# Altium schematic sheet RG191-M2 Header.SchDoc: Laird RG191-M2 LoRa Concentrator Daughterboard
size Letter; DrawnBy: MTAN; Organization: Altium Limited; DocumentNumber: 1; Revision: A; SheetNumber: 1; SheetTotal: 2
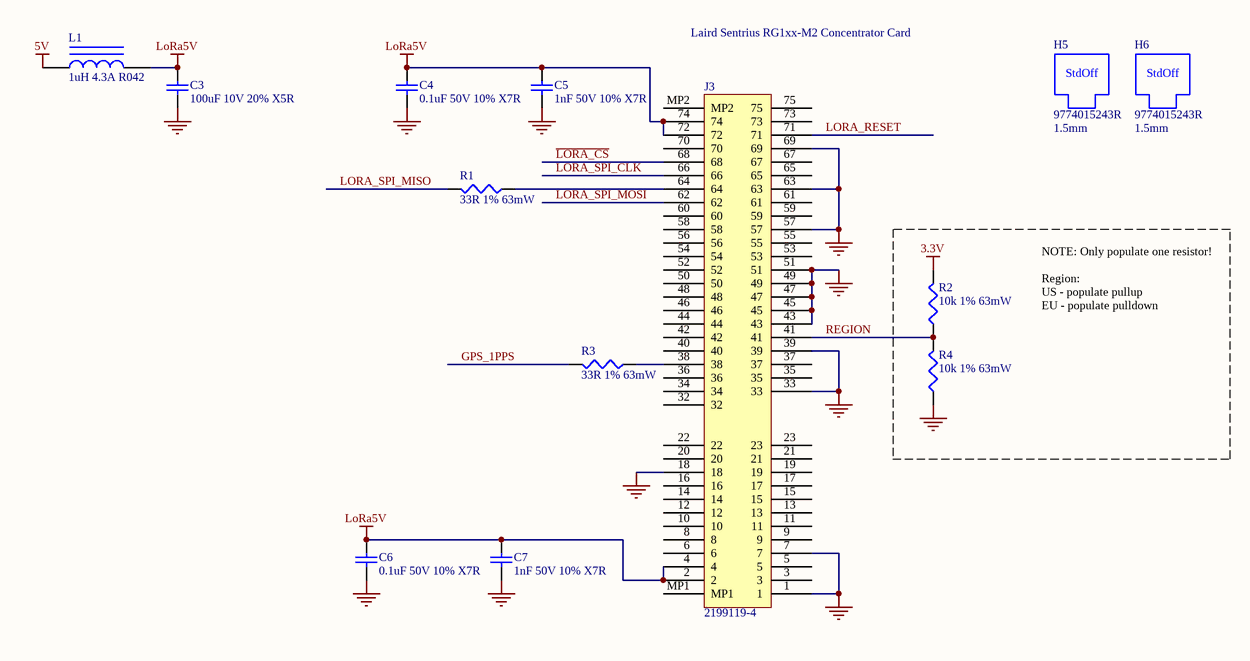
[diagram p0: RG191-M2 Header.SchDoc]

## Parts
C3  100uF 10V 20% X5R  [C1210_L]
C4  0.1uF 50V 10% X7R  [CAPC1005L]
C5  1nF 50V 10% X7R  [CAPC1005L]
C6  0.1uF 50V 10% X7R  [CAPC1005L]
C7  1nF 50V 10% X7R  [CAPC1005L]
H5  9774015243R  Height: 1.5mm  [Wurth 9774015243R]
H6  9774015243R  Height: 1.5mm  [Wurth 9774015243R]
J3  2199119-4  [TE 2199119-4]
L1  1uH 4.3A R042  [WE-LQS 252012]
R1  33R 1% 63mW  [RESC1005L]
R2  10k 1% 63mW  [RESC1005L]
R3  33R 1% 63mW  [RESC1005L]
R4  10k 1% 63mW  [RESC1005L]

## Nets
3.3V: R2.2
5V: L1.1
GND: C3.1 C4.2 C5.2 C6.2 C7.2 J3.1 J3.7 J3.18 J3.33 J3.39 J3.43 J3.45 J3.47 J3.49 J3.51 J3.57 J3.63 J3.69 R4.1
LoRa5V: C3.2 C4.1 C5.1 C6.1 C7.1 J3.2 J3.4 J3.72 J3.74 L1.2
GPS_1PPS: R3.2
~{LORA_CS}: J3.68
LORA_RESET: J3.71
LORA_SPI_CLK: J3.66
LORA_SPI_MISO: R1.2
LORA_SPI_MOSI: J3.62
REGION: J3.41 R2.1 R4.2
NetJ3_38: J3.38 R3.1
NetJ3_64: J3.64 R1.1

Not connected (* = marked no-connect by the designer): J3 3 5 6 8 9 10 11 12 13 14 15 16 17 19 20 21 22 23 32 34 35 36 37 40 42 44 46 48 50 52 53 54 55 56 58 59 60 61 65 67 70 73 75 MP1 MP2

## Notes on the sheet
- Laird Sentrius RG1xx-M2 Concentrator Card
- NOTE: Only populate one resistor!
  Region:
  US - populate pullup
  EU - populate pulldown
- Title
- Drawn By:
- Date:
- Time:
- Revision:
- Sheet
- of
- The Latium Group of Companies
- 1312 10 Street
- Nisku, Alberta
- T9E 8K2
- Canada
- File:
- (in symbol SMD 1.5mm Spacer) StdOff

## Library data of the parts
C3-C7 = Cap: Capacitor
  C3: Value: 100uF 10V 20% X5R
  C4 C6: Value: 0.1uF 50V 10% X7R
  C5 C7: Value: 1nF 50V 10% X7R
H5 H6 = SMD 1.5mm Spacer: RND STANDOFF M2X0.4 STEEL; Manufacturer: Wurth Electronics Inc; Supplier 1: Digi-Key; Value: 9774015243R; Manufacturer Part Number: 9774015243R; Supplier 1 Part Number: 732-7069-1-ND; ComponentLink1Description: Drawing; ComponentLink1URL: S:\Hardware\Data Sheets\Passive\Standoffs\Wurth 9774015243R.pdf
J3 = TE2199119-4: CONN FEMALE 67POS 0.020 GOLD; Manufacturer: TE Connectivity AMP Connectors; Value: 2199119-4; Manufacturer Part Number: 2199119-4; ComponentLink1Description: Data Sheet; ComponentLink1URL: S:\Hardware\Data Sheets\Passive\Connectors\TE NGFF M2 Connector.pdf; Supplier 1: Digi-Key; Supplier 1 Part Number: A115900CT-ND
L1 = Inductor Iron: FIXED IND 1UH 4.3A 42 MOHM SMD; Manufacturer Part Number: DFE252012P-1R0M=P2; Manufacturer: Murata Electronics; Value: 1uH 4.3A R042; Supplier 1: Digi-Key; Supplier 1 Part Number: 490-10647-1-ND
R1-R4 = Res3: Resistor
  R1 R3: Value: 33R 1% 63mW
  R2 R4: Value: 10k 1% 63mW